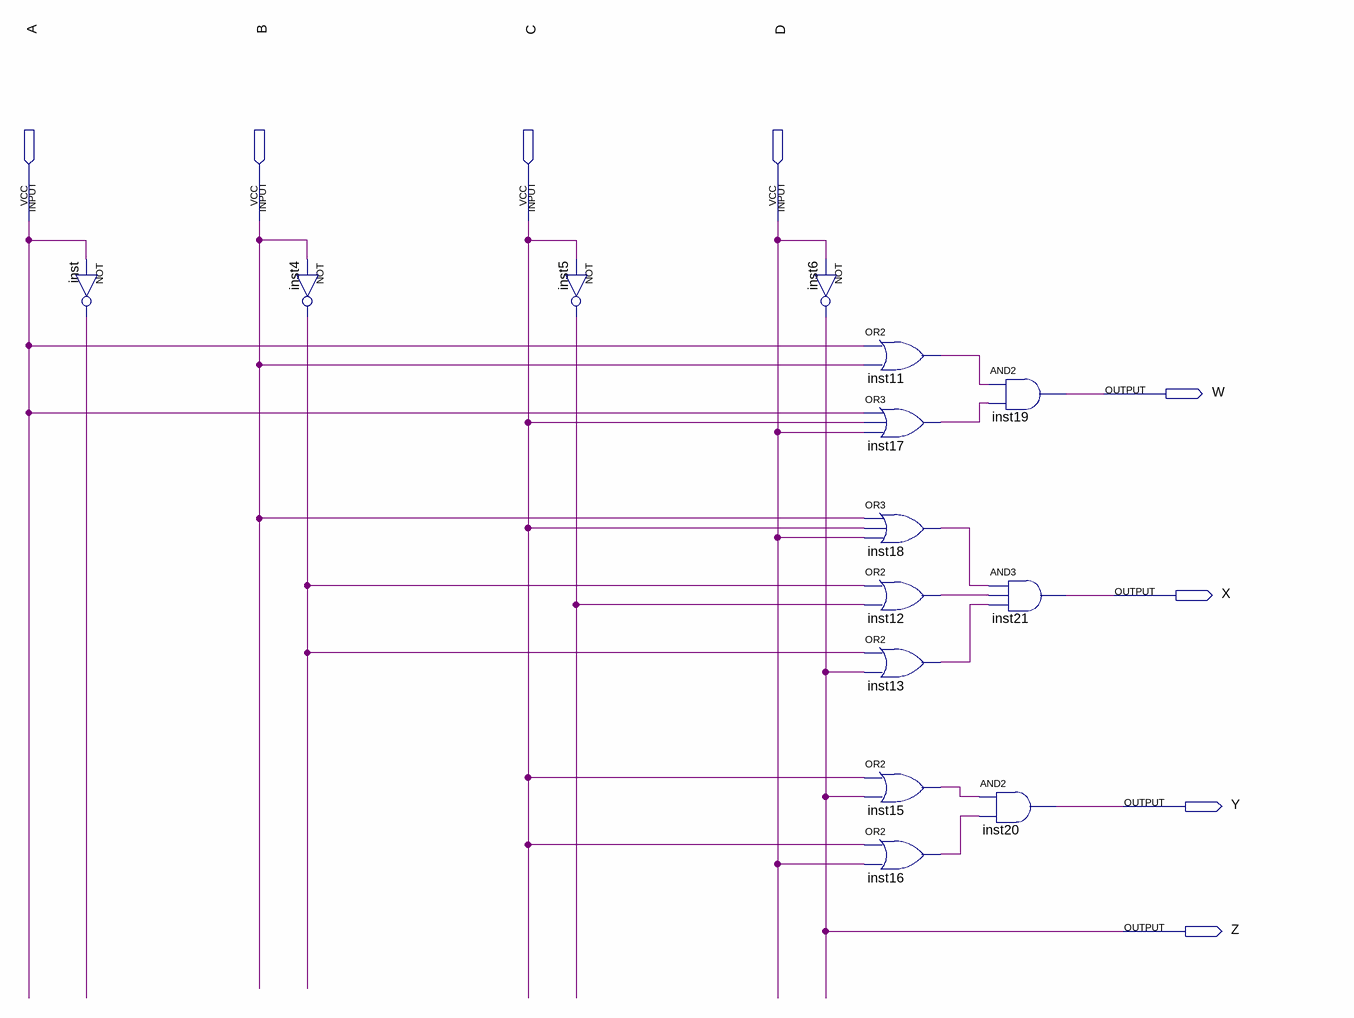
[diagram p0: schematic sheet]
// Quartus schematic pos_ex.bdf as structural Verilog: 14 symbols, 8 pins
module pos_ex (
  input  A,
  input  B,
  input  C,
  input  D,
  output W,
  output X,
  output Y,
  output Z
);

  wire inst4_out, inst5_out, inst11_out, inst12_out, inst13_out, inst15_out, inst16_out, inst17_out,
       inst18_out, inst_out;

  not inst (inst_out, A);
  not inst4 (inst4_out, B);
  not inst5 (inst5_out, C);
  not inst6 (Z, D);
  or inst11 (inst11_out, A, B);
  or inst17 (inst17_out, A, C, D);
  or inst18 (inst18_out, B, C, D);
  or inst12 (inst12_out, inst4_out, inst5_out);
  or inst13 (inst13_out, inst4_out, Z);
  or inst15 (inst15_out, C, Z);
  or inst16 (inst16_out, C, D);
  and inst19 (W, inst11_out, inst17_out);
  and inst21 (X, inst18_out, inst12_out, inst13_out);
  and inst20 (Y, inst15_out, inst16_out);
endmodule
